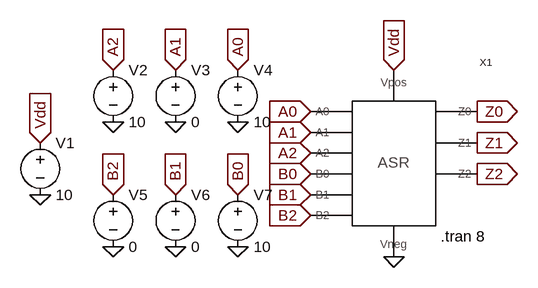
[diagram p0: schematic ASR_TESTING.asc]
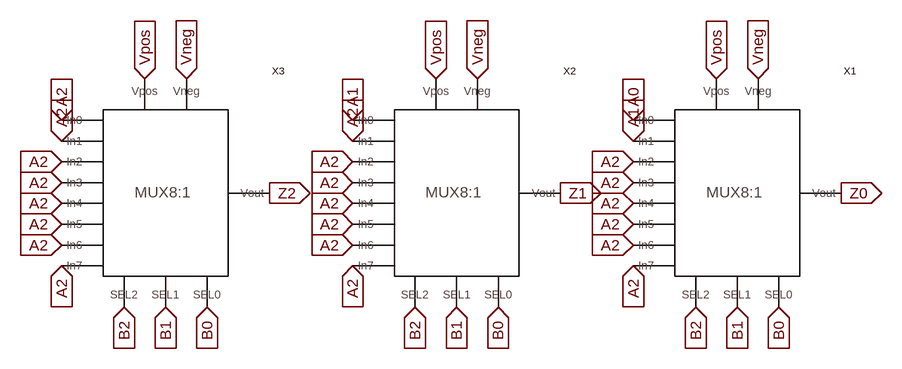
[diagram p1: sub-circuit asr_symbol.asc]
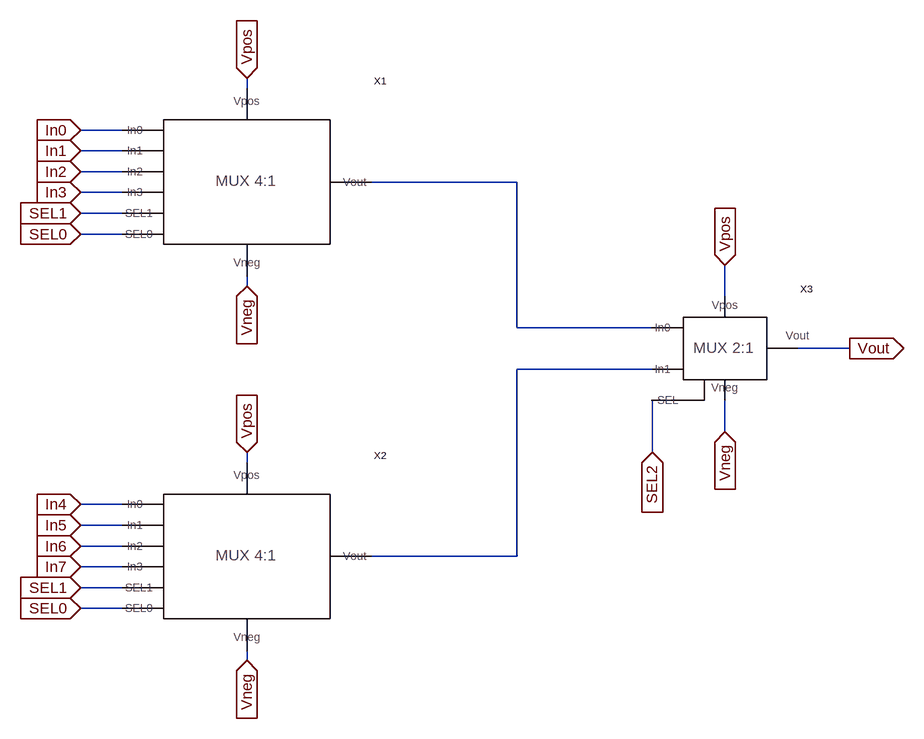
[diagram p2: sub-circuit mux_8_1_symbol.asc]
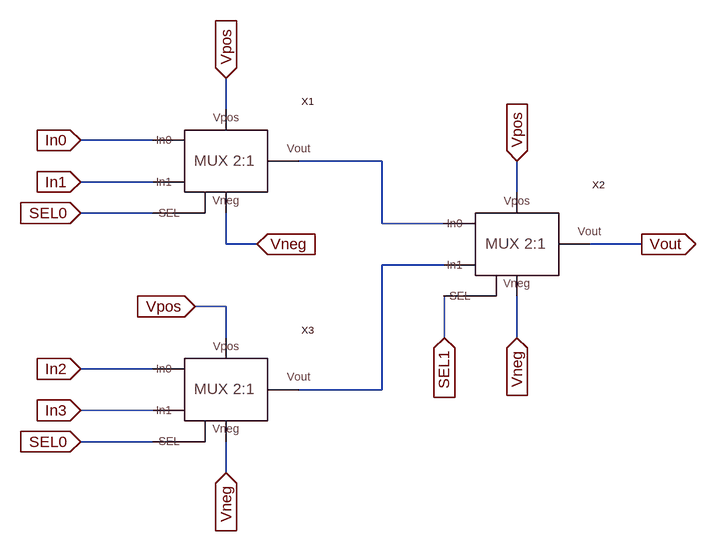
[diagram p3: sub-circuit mux4_1_sym.asc]
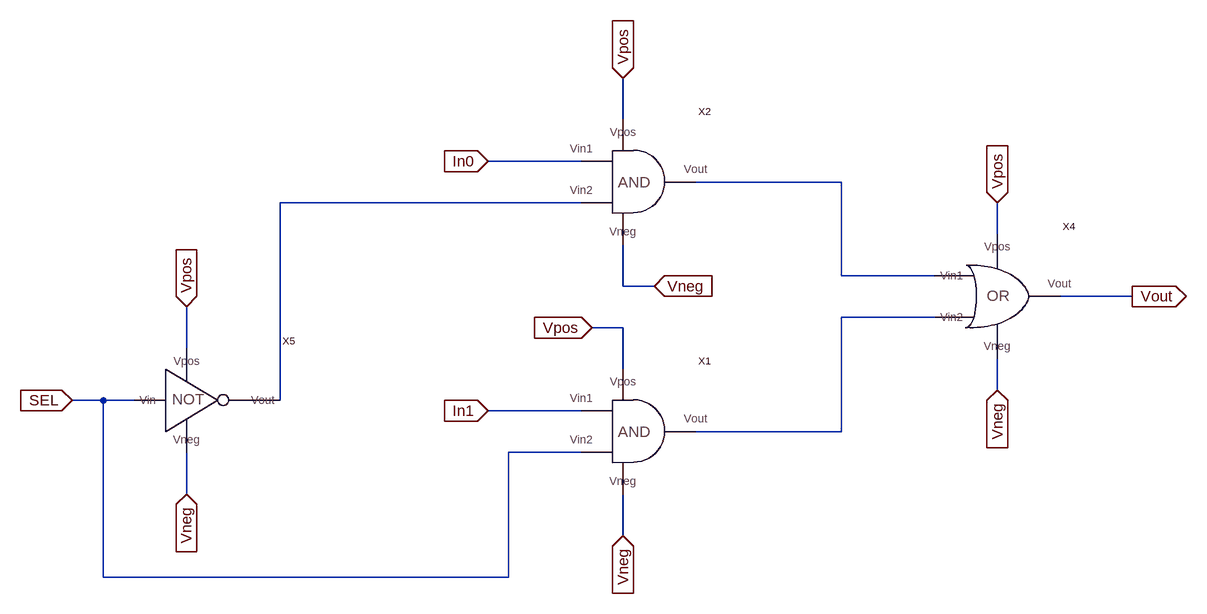
[diagram p4: sub-circuit mux2_1.asc]
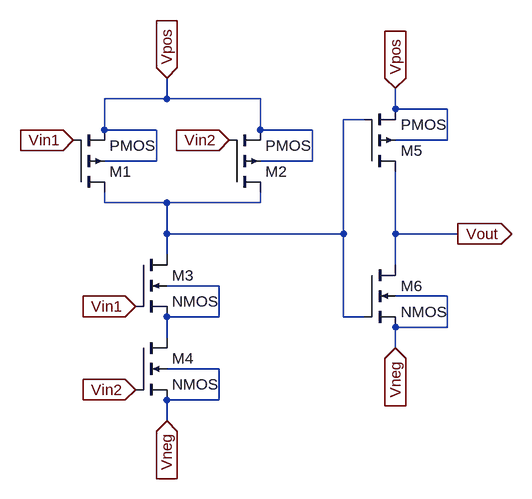
[diagram p5: sub-circuit and_sym.asc]
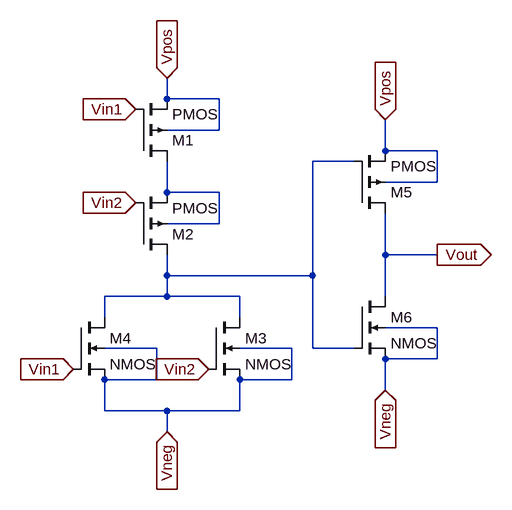
[diagram p6: sub-circuit or_sym.asc]
ASR_TESTING.asc, the LTspice schematic file:
Version 4
SHEET 1 880 680
FLAG 16 144 0
FLAG 112 144 0
FLAG -80 336 0
FLAG 16 336 0
FLAG 112 336 0
FLAG -80 144 0
FLAG -192 256 0
FLAG -192 176 Vdd
IOPIN -192 176 In
FLAG -80 64 A2
IOPIN -80 64 In
FLAG 16 64 A1
IOPIN 16 64 In
FLAG 112 64 A0
IOPIN 112 64 In
FLAG 352 64 Vdd
IOPIN 352 64 In
FLAG -80 256 B2
IOPIN -80 256 In
FLAG 16 256 B1
IOPIN 16 256 In
FLAG 112 256 B0
IOPIN 112 256 In
FLAG 224 128 A0
IOPIN 224 128 In
FLAG 224 160 A1
IOPIN 224 160 In
FLAG 224 192 A2
IOPIN 224 192 In
FLAG 224 224 B0
IOPIN 224 224 In
FLAG 224 256 B1
IOPIN 224 256 In
FLAG 224 288 B2
IOPIN 224 288 In
FLAG 480 128 Z0
IOPIN 480 128 Out
FLAG 480 176 Z1
IOPIN 480 176 Out
FLAG 480 224 Z2
IOPIN 480 224 Out
FLAG 352 352 0
SYMBOL ASR_SYMBOL 352 208 R0
SYMATTR InstName X1
SYMBOL voltage -192 160 R0
WINDOW 123 0 0 Left 0
WINDOW 39 0 0 Left 0
SYMATTR InstName V1
SYMATTR Value 10
SYMBOL voltage -80 48 R0
WINDOW 123 0 0 Left 0
WINDOW 39 0 0 Left 0
SYMATTR InstName V2
SYMATTR Value 10
SYMBOL voltage 16 48 R0
WINDOW 123 0 0 Left 0
WINDOW 39 0 0 Left 0
SYMATTR InstName V3
SYMATTR Value 0
SYMBOL voltage 112 48 R0
WINDOW 123 0 0 Left 0
WINDOW 39 0 0 Left 0
SYMATTR InstName V4
SYMATTR Value 10
SYMBOL voltage -80 240 R0
WINDOW 123 0 0 Left 0
WINDOW 39 0 0 Left 0
SYMATTR InstName V5
SYMATTR Value 0
SYMBOL voltage 16 240 R0
WINDOW 123 0 0 Left 0
WINDOW 39 0 0 Left 0
SYMATTR InstName V6
SYMATTR Value 0
SYMBOL voltage 112 240 R0
WINDOW 123 0 0 Left 0
WINDOW 39 0 0 Left 0
SYMATTR InstName V7
SYMATTR Value 10
TEXT 424 320 Left 2 !.tran 8

asr_symbol.asc, the sub-circuit schematic file:
Version 4
SHEET 1 880 1324
FLAG 80 -112 A0
IOPIN 80 -112 In
FLAG 80 -80 A1
IOPIN 80 -80 In
FLAG 80 -48 A2
IOPIN 80 -48 In
FLAG 80 -16 A2
IOPIN 80 -16 In
FLAG 80 16 A2
IOPIN 80 16 In
FLAG 80 48 A2
IOPIN 80 48 In
FLAG 80 80 A2
IOPIN 80 80 In
FLAG 80 112 A2
IOPIN 80 112 In
FLAG -352 -80 A2
IOPIN -352 -80 In
FLAG -352 -48 A2
IOPIN -352 -48 In
FLAG -352 -16 A2
IOPIN -352 -16 In
FLAG -352 16 A2
IOPIN -352 16 In
FLAG -352 48 A2
IOPIN -352 48 In
FLAG -352 80 A2
IOPIN -352 80 In
FLAG -352 112 A2
IOPIN -352 112 In
FLAG -800 -112 A2
IOPIN -800 -112 In
FLAG -800 -80 A2
IOPIN -800 -80 In
FLAG -800 -48 A2
IOPIN -800 -48 In
FLAG -800 -16 A2
IOPIN -800 -16 In
FLAG -800 16 A2
IOPIN -800 16 In
FLAG -800 48 A2
IOPIN -800 48 In
FLAG -800 80 A2
IOPIN -800 80 In
FLAG -800 112 A2
IOPIN -800 112 In
FLAG -224 -176 Vpos
IOPIN -224 -176 In
FLAG -160 -176 Vneg
IOPIN -160 -176 In
FLAG 304 176 B0
IOPIN 304 176 In
FLAG 240 176 B1
IOPIN 240 176 In
FLAG 176 176 B2
IOPIN 176 176 In
FLAG -128 176 B0
IOPIN -128 176 In
FLAG -576 176 B0
IOPIN -576 176 In
FLAG -192 176 B1
IOPIN -192 176 In
FLAG -256 176 B2
IOPIN -256 176 In
FLAG -640 176 B1
IOPIN -640 176 In
FLAG -704 176 B2
IOPIN -704 176 In
FLAG -672 -176 Vpos
IOPIN -672 -176 In
FLAG -608 -176 Vneg
IOPIN -608 -176 In
FLAG 208 -176 Vpos
IOPIN 208 -176 In
FLAG 272 -176 Vneg
IOPIN 272 -176 In
FLAG 400 0 Z0
IOPIN 400 0 Out
FLAG -32 0 Z1
IOPIN -32 0 Out
FLAG -480 0 Z2
IOPIN -480 0 Out
FLAG -352 -112 A1
IOPIN -352 -112 In
SYMBOL MUX_8_1_SYMBOL 240 0 R0
SYMATTR InstName X1
SYMBOL MUX_8_1_SYMBOL -192 0 R0
SYMATTR InstName X2
SYMBOL MUX_8_1_SYMBOL -640 0 R0
SYMATTR InstName X3

mux_8_1_symbol.asc, the sub-circuit schematic file:
Version 4
SHEET 1 1296 708
WIRE 256 -416 256 -432
WIRE 64 -352 0 -352
WIRE 64 -320 0 -320
WIRE 64 -288 0 -288
WIRE 672 -272 448 -272
WIRE 64 -256 0 -256
WIRE 64 -224 0 -224
WIRE 64 -192 0 -192
WIRE 256 -112 256 -128
WIRE 992 -96 992 -144
WIRE 672 -48 672 -272
WIRE 880 -48 672 -48
WIRE 1184 -16 1104 -16
WIRE 880 16 672 16
WIRE 992 112 992 64
WIRE 880 144 880 64
WIRE 256 160 256 144
WIRE 64 224 0 224
WIRE 64 256 0 256
WIRE 64 288 0 288
WIRE 672 304 672 16
WIRE 672 304 448 304
WIRE 64 320 0 320
WIRE 64 352 0 352
WIRE 64 384 0 384
WIRE 256 464 256 448
FLAG 0 -352 In0
IOPIN 0 -352 In
FLAG 0 -320 In1
IOPIN 0 -320 In
FLAG 0 -288 In2
IOPIN 0 -288 In
FLAG 0 -256 In3
IOPIN 0 -256 In
FLAG 0 -224 SEL1
IOPIN 0 -224 In
FLAG 0 -192 SEL0
IOPIN 0 -192 In
FLAG 0 224 In4
IOPIN 0 224 In
FLAG 0 256 In5
IOPIN 0 256 In
FLAG 0 288 In6
IOPIN 0 288 In
FLAG 0 320 In7
IOPIN 0 320 In
FLAG 0 352 SEL1
IOPIN 0 352 In
FLAG 0 384 SEL0
IOPIN 0 384 In
FLAG 256 144 Vpos
IOPIN 256 144 In
FLAG 256 -432 Vpos
IOPIN 256 -432 In
FLAG 256 -112 Vneg
IOPIN 256 -112 In
FLAG 256 464 Vneg
IOPIN 256 464 In
FLAG 880 144 SEL2
IOPIN 880 144 In
FLAG 992 112 Vneg
IOPIN 992 112 In
FLAG 992 -144 Vpos
IOPIN 992 -144 In
FLAG 1184 -16 Vout
IOPIN 1184 -16 Out
SYMBOL MUX4_1_SYM 256 -272 R0
SYMATTR InstName X1
SYMBOL MUX4_1_SYM 256 304 R0
SYMATTR InstName X2
SYMBOL MUX2_1 992 -16 R0
SYMATTR InstName X3

mux4_1_sym.asc, the sub-circuit schematic file:
Version 4
SHEET 1 880 680
WIRE 16 -112 16 -160
WIRE -96 -64 -208 -64
WIRE 256 -32 128 -32
WIRE -96 0 -208 0
WIRE 464 16 464 -32
WIRE -96 48 -208 48
WIRE 256 64 256 -32
WIRE 352 64 256 64
WIRE 16 96 16 48
WIRE 64 96 16 96
WIRE 656 96 576 96
WIRE 352 128 256 128
WIRE 16 192 -32 192
WIRE 16 240 16 192
WIRE 352 240 352 176
WIRE 464 240 464 176
WIRE -96 288 -208 288
WIRE 256 320 256 128
WIRE 256 320 128 320
WIRE -96 352 -208 352
WIRE -96 400 -208 400
WIRE 16 448 16 400
FLAG 16 -160 Vpos
IOPIN 16 -160 In
FLAG -32 192 Vpos
IOPIN -32 192 In
FLAG 464 -32 Vpos
IOPIN 464 -32 In
FLAG -208 -64 In0
IOPIN -208 -64 In
FLAG -208 0 In1
IOPIN -208 0 In
FLAG -208 288 In2
IOPIN -208 288 In
FLAG -208 352 In3
IOPIN -208 352 In
FLAG 352 240 SEL1
IOPIN 352 240 In
FLAG -208 48 SEL0
IOPIN -208 48 In
FLAG 656 96 Vout
IOPIN 656 96 Out
FLAG -208 400 SEL0
IOPIN -208 400 In
FLAG 464 240 Vneg
IOPIN 464 240 In
FLAG 16 448 Vneg
IOPIN 16 448 In
FLAG 64 96 Vneg
IOPIN 64 96 In
SYMBOL MUX2_1 16 -32 R0
SYMATTR InstName X1
SYMBOL MUX2_1 464 96 R0
SYMATTR InstName X2
SYMBOL MUX2_1 16 320 R0
SYMATTR InstName X3

mux2_1.asc, the sub-circuit schematic file:
Version 4
SHEET 1 1072 680
WIRE 176 -352 176 -416
WIRE 112 -288 -32 -288
WIRE 512 -256 288 -256
WIRE 112 -224 -352 -224
WIRE 752 -176 752 -224
WIRE 512 -112 512 -256
WIRE 656 -112 512 -112
WIRE 176 -96 176 -160
WIRE 224 -96 176 -96
WIRE 960 -80 848 -80
WIRE 656 -48 512 -48
WIRE 176 -32 128 -32
WIRE -496 0 -496 -64
WIRE 176 32 176 -32
WIRE 752 64 752 16
WIRE -624 80 -672 80
WIRE -576 80 -624 80
WIRE -352 80 -352 -224
WIRE 112 96 -32 96
WIRE 512 128 512 -48
WIRE 512 128 288 128
WIRE 112 160 0 160
WIRE -496 224 -496 160
WIRE 176 288 176 224
WIRE -624 352 -624 80
WIRE 0 352 0 160
WIRE 0 352 -624 352
FLAG -32 -288 In0
IOPIN -32 -288 In
FLAG -32 96 In1
IOPIN -32 96 In
FLAG -672 80 SEL
IOPIN -672 80 In
FLAG 176 -416 Vpos
IOPIN 176 -416 In
FLAG 224 -96 Vneg
IOPIN 224 -96 In
FLAG 128 -32 Vpos
IOPIN 128 -32 In
FLAG 752 -224 Vpos
IOPIN 752 -224 In
FLAG 752 64 Vneg
IOPIN 752 64 In
FLAG 176 288 Vneg
IOPIN 176 288 In
FLAG -496 -64 Vpos
IOPIN -496 -64 In
FLAG -496 224 Vneg
IOPIN -496 224 In
FLAG 960 -80 Vout
IOPIN 960 -80 Out
SYMBOL AND_SYM 192 128 R0
SYMATTR InstName X1
SYMBOL AND_SYM 192 -256 R0
SYMATTR InstName X2
SYMBOL OR_SYM 768 -80 R0
SYMATTR InstName X4
SYMBOL NOT_SYM -496 80 R0
SYMATTR InstName X5

and_sym.asc, the sub-circuit schematic file:
Version 4
SHEET 1 880 680
WIRE 272 -16 272 -48
WIRE 272 -16 176 -16
WIRE 416 -16 272 -16
WIRE 624 0 624 -32
WIRE 704 0 624 0
WIRE 576 16 544 16
WIRE 176 32 176 -16
WIRE 256 32 176 32
WIRE 416 32 416 -16
WIRE 496 32 416 32
WIRE 704 48 704 0
WIRE 704 48 624 48
WIRE 256 80 256 32
WIRE 256 80 176 80
WIRE 496 80 496 32
WIRE 496 80 416 80
WIRE 176 144 176 128
WIRE 272 144 176 144
WIRE 416 144 416 128
WIRE 416 144 272 144
WIRE 272 192 272 144
WIRE 544 192 544 16
WIRE 544 192 272 192
WIRE 624 192 624 96
WIRE 720 192 624 192
WIRE 272 224 272 192
WIRE 624 240 624 192
WIRE 352 272 272 272
WIRE 704 288 624 288
WIRE 352 320 352 272
WIRE 352 320 272 320
WIRE 544 320 544 192
WIRE 576 320 544 320
WIRE 704 336 704 288
WIRE 704 336 624 336
WIRE 272 352 272 320
WIRE 624 368 624 336
WIRE 352 400 272 400
WIRE 352 448 352 400
WIRE 352 448 272 448
WIRE 272 480 272 448
FLAG 272 -48 Vpos
IOPIN 272 -48 In
FLAG 128 48 Vin1
IOPIN 128 48 In
FLAG 224 304 Vin1
IOPIN 224 304 In
FLAG 224 432 Vin2
IOPIN 224 432 In
FLAG 720 192 Vout
IOPIN 720 192 Out
FLAG 368 48 Vin2
IOPIN 368 48 In
FLAG 272 480 Vneg
IOPIN 272 480 In
FLAG 624 -32 Vpos
IOPIN 624 -32 In
FLAG 624 368 Vneg
IOPIN 624 368 In
SYMBOL pmos4 128 128 M180
SYMATTR InstName M1
SYMBOL pmos4 368 128 M180
SYMATTR InstName M2
SYMBOL nmos4 224 224 R0
SYMATTR InstName M3
SYMBOL nmos4 224 352 R0
SYMATTR InstName M4
SYMBOL pmos4 576 96 M180
SYMATTR InstName M5
SYMBOL nmos4 576 240 R0
SYMATTR InstName M6

or_sym.asc, the sub-circuit schematic file:
Version 4
SHEET 1 880 680
WIRE 128 -128 128 -160
WIRE 208 -128 128 -128
WIRE 208 -80 208 -128
WIRE 208 -80 128 -80
WIRE 464 -48 464 -96
WIRE 544 -48 464 -48
WIRE 416 -32 352 -32
WIRE 544 0 544 -48
WIRE 544 0 464 0
WIRE 128 16 128 -32
WIRE 208 16 128 16
WIRE 208 64 208 16
WIRE 208 64 128 64
WIRE 464 112 464 48
WIRE 544 112 464 112
WIRE 128 144 128 112
WIRE 352 144 352 -32
WIRE 352 144 128 144
WIRE 128 176 128 144
WIRE 128 176 32 176
WIRE 240 176 128 176
WIRE 464 176 464 112
WIRE 32 208 32 176
WIRE 240 208 240 176
WIRE 544 224 464 224
WIRE 112 256 32 256
WIRE 320 256 240 256
WIRE 352 256 352 144
WIRE 416 256 352 256
WIRE 544 272 544 224
WIRE 544 272 464 272
WIRE 112 304 112 256
WIRE 112 304 32 304
WIRE 320 304 320 256
WIRE 320 304 240 304
WIRE 464 320 464 272
WIRE 32 352 32 304
WIRE 128 352 32 352
WIRE 240 352 240 304
WIRE 240 352 128 352
WIRE 128 384 128 352
FLAG 128 -160 Vpos
IOPIN 128 -160 In
FLAG 128 384 Vneg
IOPIN 128 384 In
FLAG -16 288 Vin1
IOPIN -16 288 In
FLAG 192 288 Vin2
IOPIN 192 288 In
FLAG 80 -112 Vin1
IOPIN 80 -112 In
FLAG 80 32 Vin2
IOPIN 80 32 In
FLAG 544 112 Vout
IOPIN 544 112 Out
FLAG 464 -96 Vpos
IOPIN 464 -96 In
FLAG 464 320 Vneg
IOPIN 464 320 In
SYMBOL pmos4 80 -32 M180
SYMATTR InstName M1
SYMBOL pmos4 80 112 M180
SYMATTR InstName M2
SYMBOL nmos4 192 208 R0
SYMATTR InstName M3
SYMBOL nmos4 -16 208 R0
SYMATTR InstName M4
SYMBOL pmos4 416 48 M180
SYMATTR InstName M5
SYMBOL nmos4 416 176 R0
SYMATTR InstName M6

The netlist it stands for:
* ASR_TESTING.asc
XX1 A0 A1 A2 B0 B1 B2 Z0 Z1 Z2 Vdd 0 asr_symbol
V1 Vdd 0 10
V2 A2 0 10
V3 A1 0 0
V4 A0 0 10
V5 B2 0 0
V6 B1 0 0
V7 B0 0 10

* block symbol definitions
.subckt asr_symbol A0 A1 A2 B0 B1 B2 Z0 Z1 Z2 Vpos Vneg
XX1 Vpos A0 A1 A2 A2 A2 A2 A2 A2 B1 B2 B0 Z0 Vneg mux_8_1_symbol
XX2 Vpos A1 A2 A2 A2 A2 A2 A2 A2 B1 B2 B0 Z1 Vneg mux_8_1_symbol
XX3 Vpos A2 A2 A2 A2 A2 A2 A2 A2 B1 B2 B0 Z2 Vneg mux_8_1_symbol
.ends asr_symbol

.subckt mux_8_1_symbol Vpos In0 In1 In2 In3 In4 In5 In6 In7 SEL1 SEL2 SEL0 Vout Vneg
XX1 N001 Vpos Vneg In0 In1 In2 In3 SEL1 SEL0 mux4_1_sym
XX2 N002 Vpos Vneg In4 In5 In6 In7 SEL1 SEL0 mux4_1_sym
XX3 N001 N002 SEL2 Vpos Vneg Vout mux2_1
.ends mux_8_1_symbol

.subckt mux4_1_sym Vout Vpos Vneg In0 In1 In2 In3 SEL1 SEL0
XX1 In0 In1 SEL0 Vpos Vneg N001 mux2_1
XX2 N001 N002 SEL1 Vpos Vneg Vout mux2_1
XX3 In2 In3 SEL0 Vpos Vneg N002 mux2_1
.ends mux4_1_sym

.subckt mux2_1 In0 In1 SEL Vpos Vneg Vout
XX1 In1 SEL Vpos Vneg N003 and_sym
XX2 In0 N002 Vpos Vneg N001 and_sym
XX4 Vpos N001 N003 Vout Vneg or_sym
XX5 SEL Vpos N002 Vneg NOT_SYM  ; pins Vin Vpos Vout Vneg
.ends mux2_1

.subckt and_sym Vin1 Vin2 Vpos Vneg Vout
M1 N001 Vin1 Vpos Vpos PMOS
M2 N001 Vin2 Vpos Vpos PMOS
M3 N001 Vin1 N002 N002 NMOS
M4 N002 Vin2 Vneg Vneg NMOS
M5 Vout N001 Vpos Vpos PMOS
M6 Vout N001 Vneg Vneg NMOS
.ends and_sym

.subckt or_sym Vpos Vin1 Vin2 Vout Vneg
M1 N002 Vin1 Vpos Vpos PMOS
M2 N001 Vin2 N002 N002 PMOS
M3 N001 Vin2 Vneg Vneg NMOS
M4 N001 Vin1 Vneg Vneg NMOS
M5 Vout N001 Vpos Vpos PMOS
M6 Vout N001 Vneg Vneg NMOS
.ends or_sym

.model NMOS NMOS
.model PMOS PMOS
.lib standard.mos
.tran 8
.backanno
.end

* Results of the author's LTspice run, read from the files saved beside the schematic
* Operating Point, zero values left out:
*   V(vdd) = 10 V
*   V(b0) = 10 V
*   V(a0) = 10 V
*   V(a2) = 10 V
*   V(z0) = 100.1 nV
*   V(z1) = 10 V
*   V(z2) = 10 V
*   I(V1) = -3.352 nA
*   Ix(x1:VPOS) = 3.352 nA
*   Ix(x1:VNEG) = -3.352 nA
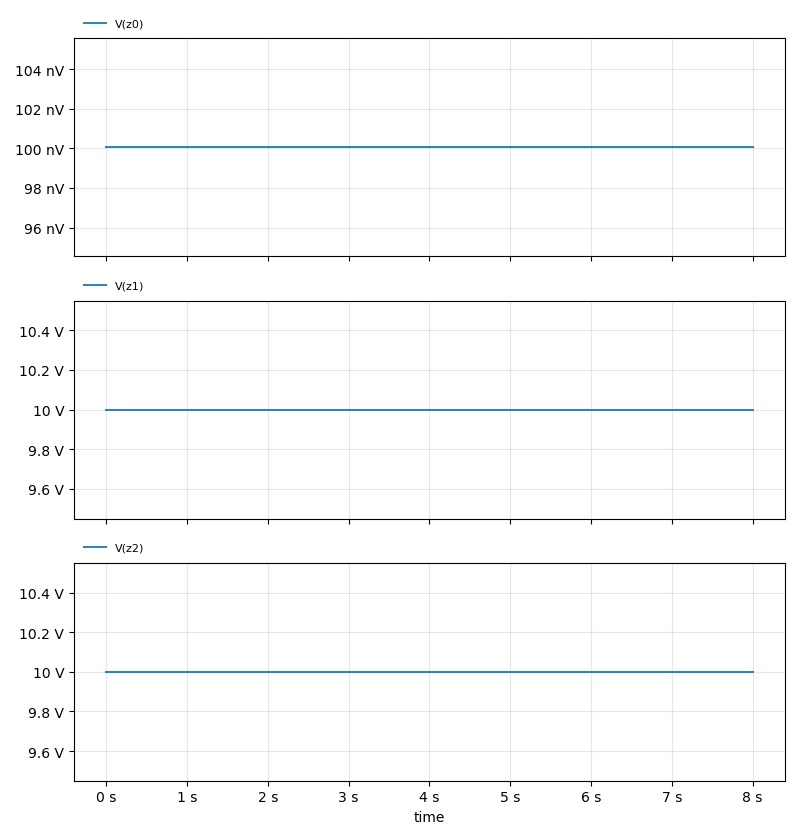
[diagram p7: Transient Analysis of ASR_TESTING.asc, plotted from the saved traces]
* Transient Analysis, 1 run:
*   V(z0): min 100.1 nV, max 100.1 nV, average 100.1 nV, rms 100.1 nV, last 100.1 nV
*   V(z1): min 10 V, max 10 V, average 10 V, rms 10 V, last 10 V
*   V(z2): min 10 V, max 10 V, average 10 V, rms 10 V, last 10 V